# EasyEDA schematic arduino cruise control.json
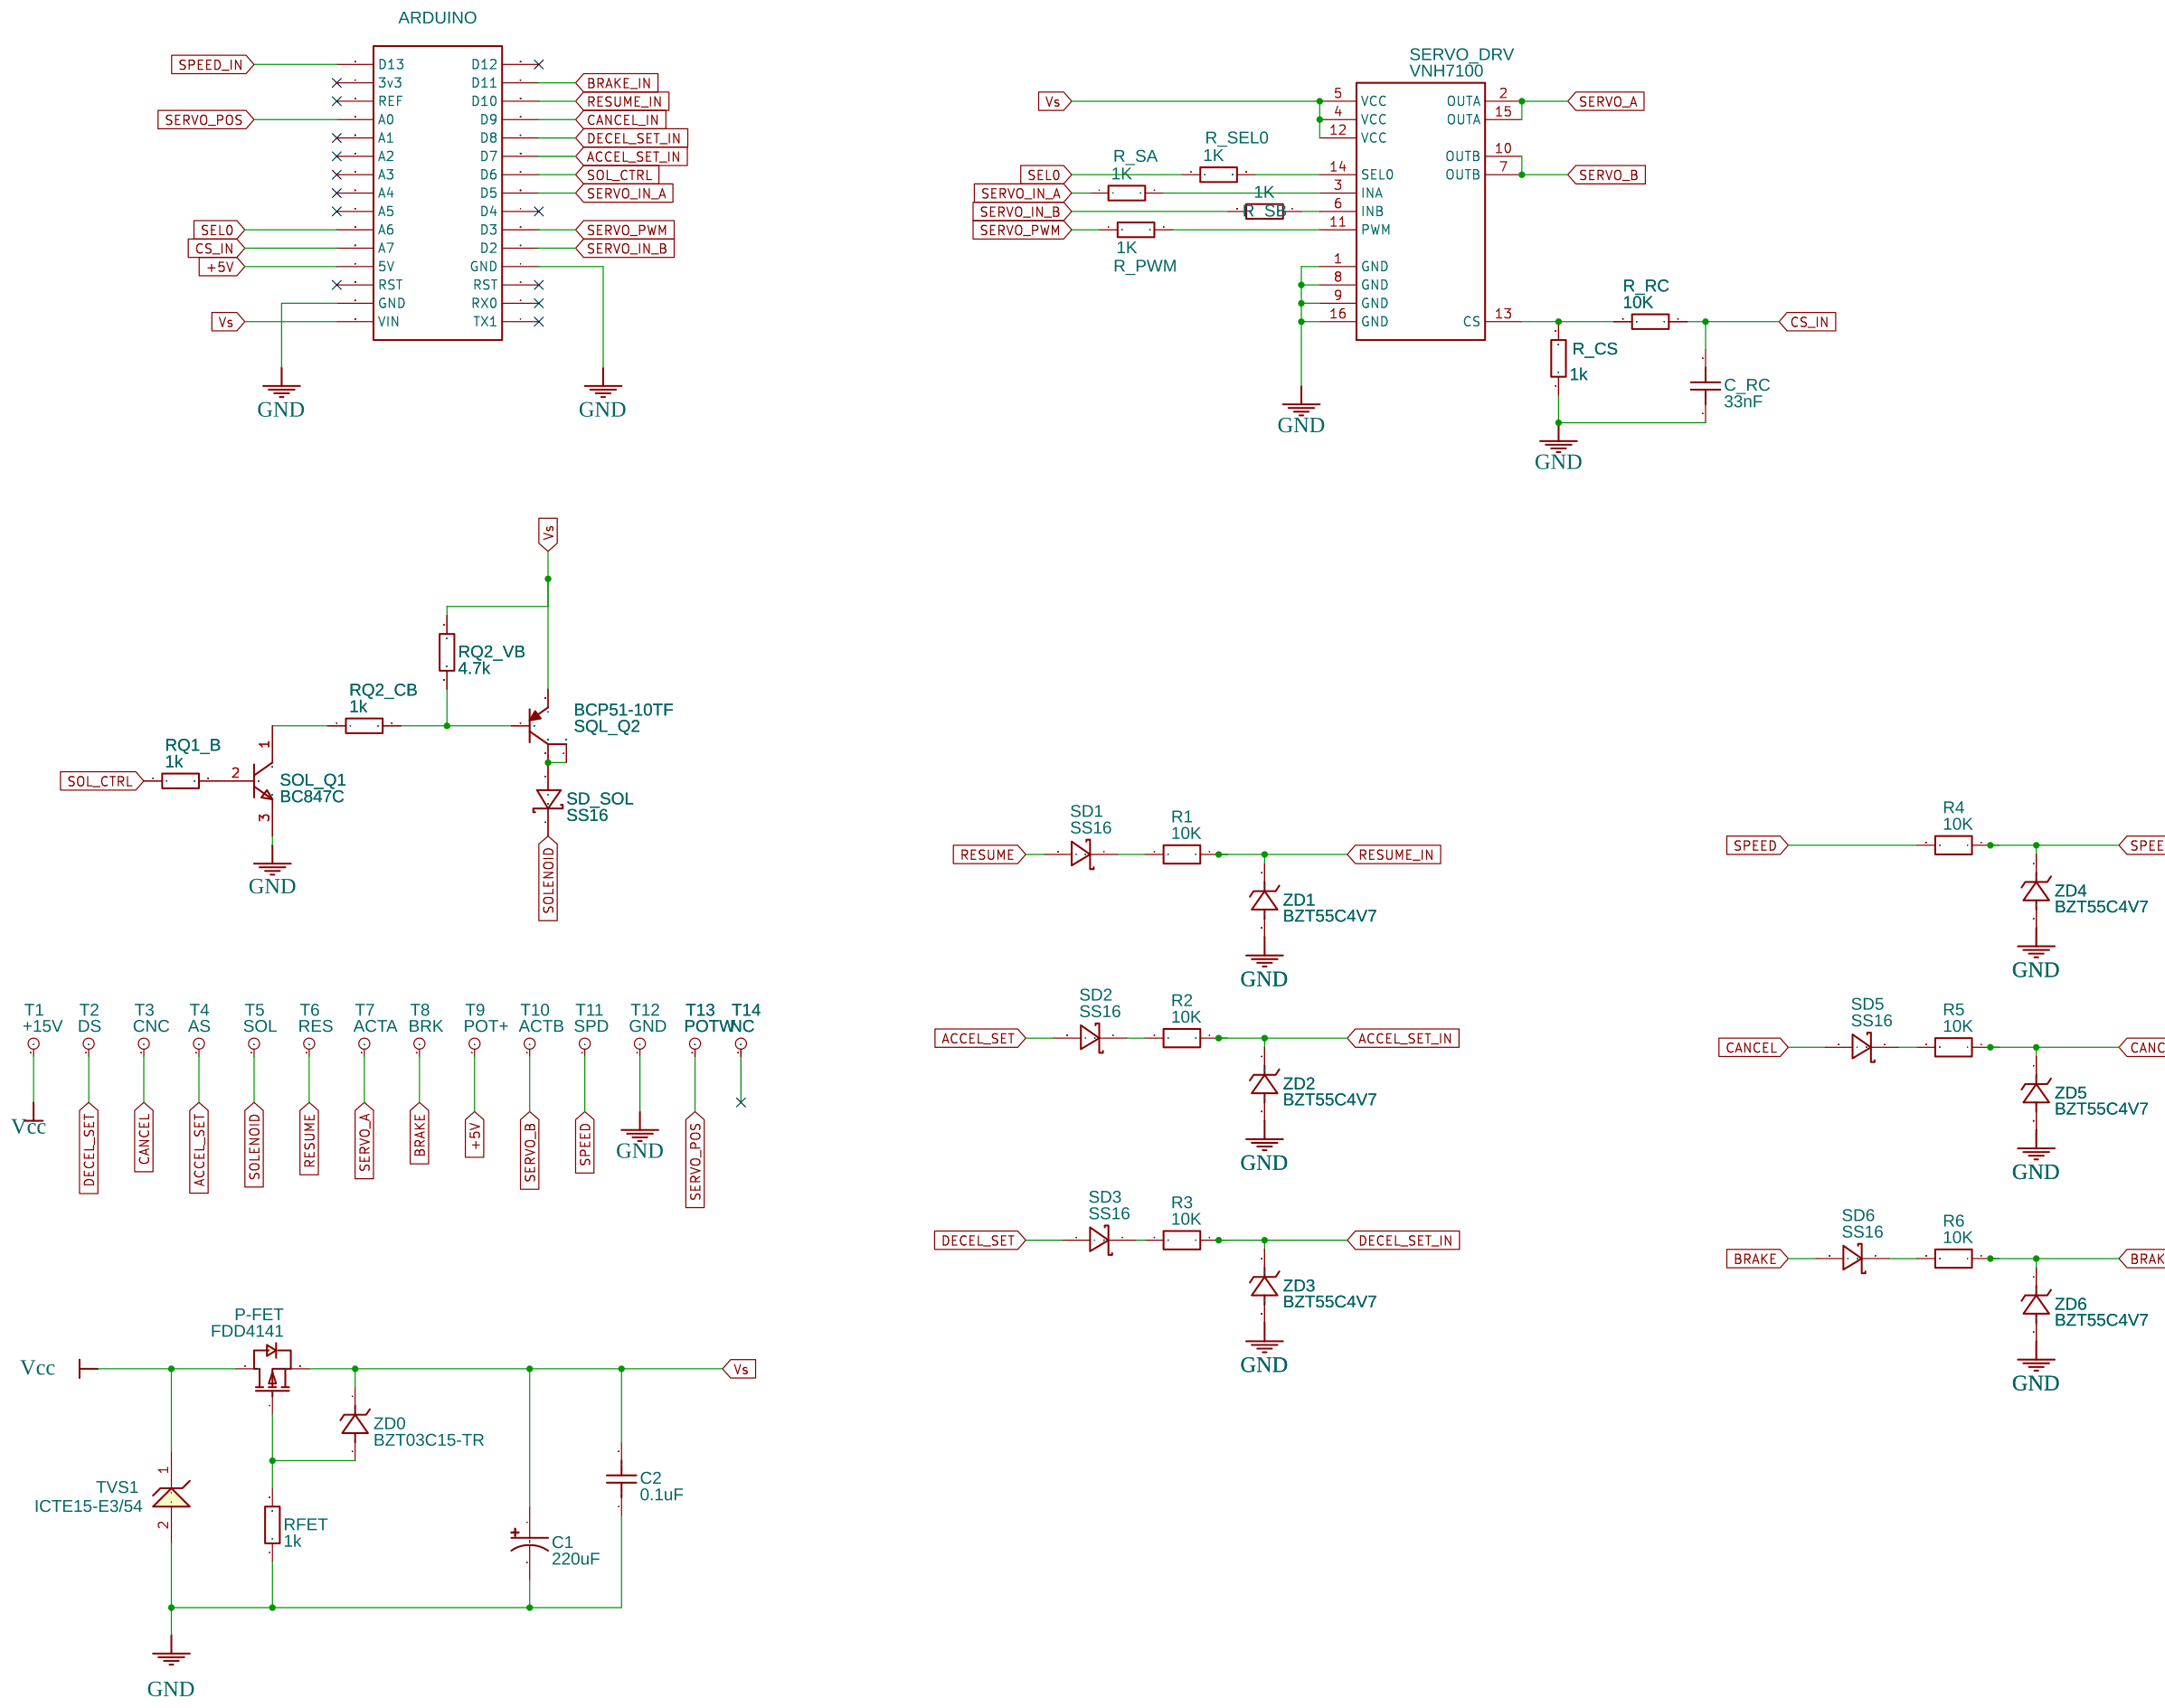
[diagram p0: schematic sheet]

## Parts
ARDUINO  Arduino Nano Every  [ARDUINO NANO EVERY SMD]
C1  220uF  [CAP-SMD_BD10.0-L10.5-W10.5-FD]
C2  0.1uF  [C1206]
C_RC  33nF  [C1206]
P-FET  FDD4141  [TO-252-2_L6.6-W6.1-P4.56-LS9.9-TL]
R1  10K  [R1206]
R2  10K  [R1206]
R3  10K  [R1206]
R4  10K  [R1206]
R5  10K  [R1206]
R6  10K  [R1206]
R_CS  1k  [R1206]
R_PWM  1K  [R1206]
R_RC  10K  [R1206]
R_SA  1K  [R1206]
R_SB  1K  [R1206]
R_SEL0  1K  [R1206]
RFET  1k  [R2512]
RQ1_B  1k  [R1206]
RQ2_CB  1k  [R1206]
RQ2_VB  4.7k  [R1206]
SD1  SS16  [DO-214AC_L4.3-W2.7-LS5.3-RD]
SD2  SS16  [DO-214AC_L4.3-W2.7-LS5.3-RD]
SD3  SS16  [DO-214AC_L4.3-W2.7-LS5.3-RD]
SD5  SS16  [DO-214AC_L4.3-W2.7-LS5.3-RD]
SD6  SS16  [DO-214AC_L4.3-W2.7-LS5.3-RD]
SD_SOL  SS16  [DO-214AC_L4.3-W2.7-LS5.3-RD]
SERVO_DRV  VNH7100  [SO-16_L9.9-W3.9-P1.27-LS6.0-BL]
SOL_Q1  BC847C  [SOT-23_L2.9-W1.3-P0.95-LS2.4-TR-CW]
SQL_Q2  BCP51-10TF  [SOT-223-4_L6.5-W3.5-P2.30-LS7.0-BR]
T1  +15V  [CON_PAD_SQUARE_32MIL]
T2  DS  [CON_PAD_SQUARE_32MIL]
T3  CNC  [CON_PAD_SQUARE_32MIL]
T4  AS  [CON_PAD_SQUARE_32MIL]
T5  SOL  [CON_PAD_SQUARE_32MIL]
T6  RES  [CON_PAD_SQUARE_32MIL]
T7  ACTA  [CON_PAD_SQUARE_32MIL]
T8  BRK  [CON_PAD_SQUARE_32MIL]
T9  POT+  [CON_PAD_SQUARE_32MIL]
T10  ACTB  [CON_PAD_SQUARE_32MIL]
T11  SPD  [CON_PAD_SQUARE_32MIL]
T12  GND  [CON_PAD_SQUARE_32MIL]
T13  POTW  [CON_PAD_SQUARE_32MIL]
T14  NC  [CON_PAD_SQUARE_32MIL]
TVS1  ICTE15-E3/54  [DO-201AD_BD5.3-L8.4-P12.50-D1.4-RD]
ZD0  BZT03C15-TR  [SOD-57_BD3.6-L4.0-P8.00-D1.2-RD]
ZD1  BZT55C4V7  [MINIMELF_L3.5-W1.5-RD]
ZD2  BZT55C4V7  [MINIMELF_L3.5-W1.5-RD]
ZD3  BZT55C4V7  [MINIMELF_L3.5-W1.5-RD]
ZD4  BZT55C4V7  [MINIMELF_L3.5-W1.5-RD]
ZD5  BZT55C4V7  [MINIMELF_L3.5-W1.5-RD]
ZD6  BZT55C4V7  [MINIMELF_L3.5-W1.5-RD]

## Library data of the parts
ARDUINO = ARDUINO NANO EVERY SOLDER PADS SPEC.V2: Manufacturer: Arduino; Manufacturer Part: ABX00028; Supplier Part: 3404690; Supplier: Farnell; Contributor: Nagus; Package Display: No
C1 = EEEFT1H221GP: Supplier: Farnell; Supplier Part: 2466237; Manufacturer: Würth Elektronik; Manufacturer Part: 865060657012; Contributor: LCSC
C2 = TCC1206X7R225M250FT: Supplier: Farnell; Supplier Part: 2581103; Manufacturer: Kemet; Manufacturer Part: C1206C104M5RACTU; Contributor: LCSC
C_RC = TCC1206X7R225M250FT: Supplier: Farnell; Supplier Part: 2906070; Manufacturer: Kemet; Manufacturer Part: C1206X333K5RACTU; Contributor: LCSC
P-FET = FDD4141_C140697: Supplier: Farnell; Supplier Part: 2992319; Manufacturer: ON Semiconductor; Manufacturer Part: FDD4141-F085; Contributor: LCSC
R1-R6 = R_2512_EU: Supplier Part: 2694438; Supplier: Farnell; Contributor: LCEDA_Lib; Manufacturer Part: MCWF12P1002FTL; Manufacturer: Multicomp
R_CS R_SEL0 = CF1/4W-1KΩ±5% T52: Supplier: Farnell; Supplier Part: 2694437; Manufacturer: Multicomp; Manufacturer Part: MCWF12P1001FTL; Contributor: LCSC; Package Display: No
R_PWM R_SA R_SB RQ1_B RQ2_CB = CF1/4W-1KΩ±5% T52: Supplier: Farnell; Supplier Part: 2694437; Manufacturer: Multicomp; Manufacturer Part: MCWF12P1001FTL; Contributor: LCSC
R_RC = CF1/4W-1KΩ±5% T52: Supplier: Farnell; Supplier Part: 2694438; Manufacturer: Multicomp; Manufacturer Part: MCWF12P1002FTL; Contributor: LCSC; Package Display: No
RFET = CF1/4W-1KΩ±5% T52: Supplier: Farnell; Supplier Part: 2321763; Manufacturer: Bourns; Manufacturer Part: CRM2512-FX-1001ELF; Contributor: LCSC
RQ2_VB = CF1/4W-1KΩ±5% T52: Supplier: Farnell; Supplier Part: 1100209; Manufacturer: Welwyn; Manufacturer Part: WCR1206-4K7FI; Contributor: LCSC
SD1-SD3 SD5 SD6 SD_SOL = SS16-E3/61T: Supplier: Farnell; Supplier Part: 2101190; Manufacturer: Multicomp; Manufacturer Part: SS16.; Contributor: LCSC
SERVO_DRV = VNH7100: Manufacturer: STMicroelectronics; Manufacturer Part: VNH7100ASTR; Supplier: Farnell; Supplier Part: 2797972; link: https://www.st.com/content/ccc/resource/technical/document/datasheet/de/ba/c5/85/7e/00/43/e1/DM00213992.pdf/files/DM00213992.pdf/jcr:content/translations/en.DM00213992.pdf; Contributor: chadgeorge42
SOL_Q1 = BC547C: Amplifier Transistor, NPN Silicon, 3-Pin TO-92, Bulk Box; Manufacturer Part: BC847C,215; Supplier: Farnell; Supplier Part: 1081235; Manufacturer: Nexperia
SQL_Q2 = BCP51-10TF: Supplier: Farnell; Supplier Part: 3212664; Manufacturer: Nexperia; Contributor: LCSC
T1-T14 = PAD_TERMINAL-32MIL_SQUARE: Terminal connection pad; Contributor: DangerousPrototype
TVS1 = 1N6377: 1500 W Peak Power, Mosorb(TM) Zener Transient Voltage Suppressor, 2-Pin MOSORB, Bulk Box; Package Display: No; image: //image.lceda.cn/szlcsc/C3058.jpg; Supplier: Farnell; Manufacturer: Vishay; Supplier Part: 2335234
ZD0 = BZV55-C9V1,135: Supplier: Farnell; Supplier Part: 9398317; Manufacturer: Vishay; Contributor: LCSC
ZD1-ZD6 = BZV55-C5V1,135: Supplier: Farnell; Supplier Part: 1617757; Manufacturer: Vishay; Manufacturer Part: BZT55C4V7-GS08; Contributor: LCSC

## Nets
+5V: ARDUINO.27(5V) T9.P
GND: ARDUINO.4(GND) ARDUINO.29(GND) C1.2 C2.1 C_RC.1 R_CS.1 RFET.1 SERVO_DRV.1(GND) SERVO_DRV.8(GND) SERVO_DRV.9(GND) SERVO_DRV.16(GND) SOL_Q1.3(E) T12.P TVS1.2(A) ZD1.2(A) ZD2.2(A) ZD3.2(A) ZD4.2(A) ZD5.2(A) ZD6.2(A)
Vcc: P-FET.2(D) T1.P TVS1.1(K)
ACCEL_SET: SD2.2(A) T4.P
ACCEL_SET_IN: ARDUINO.10(D7) R2.1 ZD2.1(K)
BRAKE: SD6.2(A) T8.P
BRAKE_IN: ARDUINO.14(D11) R6.1 ZD6.1(K)
CANCEL: SD5.2(A) T3.P
CANCEL_IN: ARDUINO.12(D9) R5.1 ZD5.1(K)
CS_IN: ARDUINO.26(A7) C_RC.2 R_RC.1
DECEL_SET: SD3.2(A) T2.P
DECEL_SET_IN: ARDUINO.11(D8) R3.1 ZD3.1(K)
RESUME: SD1.2(A) T6.P
RESUME_IN: ARDUINO.13(D10) R1.1 ZD1.1(K)
SEL0: ARDUINO.25(A6) R_SEL0.1
SERVO_A: SERVO_DRV.2(OUTA) SERVO_DRV.15(OUTA) T7.P
SERVO_B: SERVO_DRV.7(OUTB) SERVO_DRV.10(OUTB) T10.P
SERVO_IN_A: ARDUINO.8(D5) R_SA.1
SERVO_IN_B: ARDUINO.5(D2) R_SB.2
SERVO_POS: ARDUINO.19(A0) T13.P
SERVO_PWM: ARDUINO.6(D3) R_PWM.1
SOL_CTRL: ARDUINO.9(D6) RQ1_B.1
SOLENOID: SD_SOL.1(C) T5.P
SPEED: R4.2 T11.P
SPEED_IN: ARDUINO.16(D13) R4.1 ZD4.1(K)
Vs: ARDUINO.30(VIN) C1.1 C2.2 P-FET.3(S) RQ2_VB.1 SERVO_DRV.4(VCC) SERVO_DRV.5(VCC) SERVO_DRV.12(VCC) SQL_Q2.3(E) ZD0.1(K)
Net-(P-FET-1): P-FET.1(G) RFET.2 ZD0.2(A)
Net-(R1-2): R1.2 SD1.1(C)
Net-(R2-2): R2.2 SD2.1(C)
Net-(R3-2): R3.2 SD3.1(C)
Net-(R5-2): R5.2 SD5.1(C)
Net-(R6-2): R6.2 SD6.1(C)
Net-(R_CS-2): R_CS.2 R_RC.2 SERVO_DRV.13(CS)
Net-(R_PWM-2): R_PWM.2 SERVO_DRV.11(PWM)
Net-(R_SA-2): R_SA.2 SERVO_DRV.3(INA)
Net-(R_SB-1): R_SB.1 SERVO_DRV.6(INB)
Net-(R_SEL0-2): R_SEL0.2 SERVO_DRV.14(SEL0)
Net-(RQ1_B-2): RQ1_B.2 SOL_Q1.2(B)
Net-(RQ2_CB-1): RQ2_CB.1 SOL_Q1.1(C)
Net-(RQ2_CB-2): RQ2_CB.2 RQ2_VB.2 SQL_Q2.1(B)
Net-(SD_SOL-2): SD_SOL.2(A) SQL_Q2.2(C) SQL_Q2.4(C)

Not connected (* = marked no-connect by the designer): ARDUINO 1(TX1)* 2(RX0)* 3(RST)* 7(D4)* 15(D12)* 17(3v3)* 18(REF)* 20(A1)* 21(A2)* 22(A3)* 23(A4)* 24(A5)* 28(RST)*; T14 P
